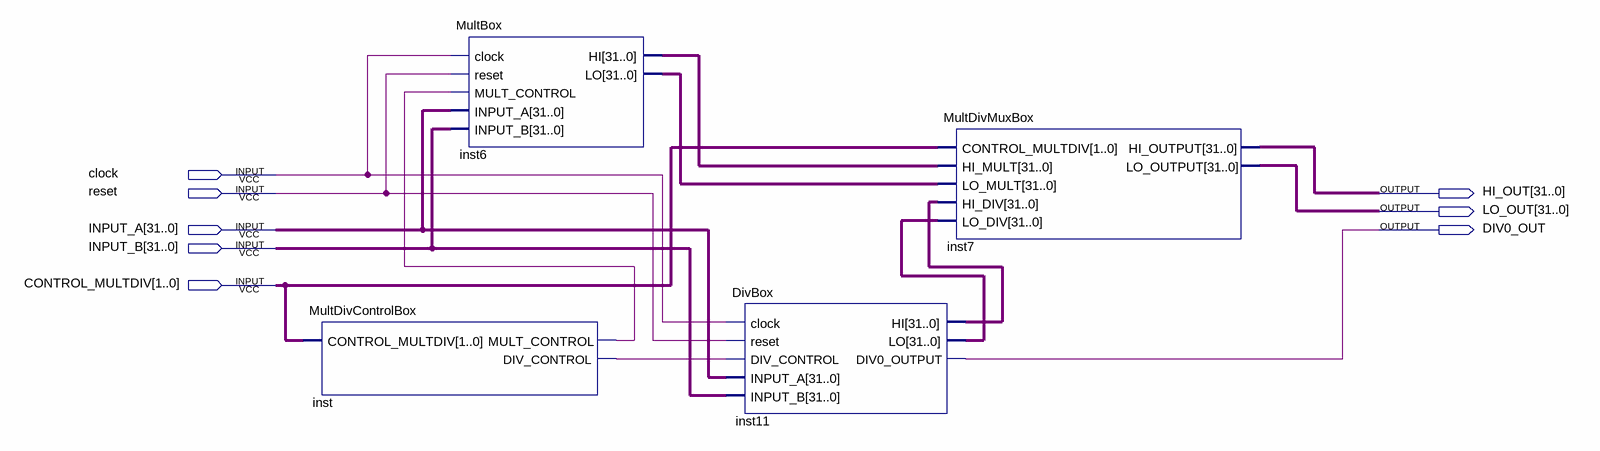
[diagram p0: schematic sheet]
// Quartus schematic MultDiv.bdf as structural Verilog: 4 symbols, 8 pins
module MultDiv (
  input  clock,
  input  reset,
  input  [31:0] INPUT_A,
  input  [31:0] INPUT_B,
  input  [1:0] CONTROL_MULTDIV,
  output [31:0] HI_OUT,
  output [31:0] LO_OUT,
  output DIV0_OUT
);

  wire inst_div_control, inst_mult_control;
  wire [31:0] inst6_hi, inst6_lo, inst11_hi, inst11_lo;

  MultDivControlBox inst (
    .CONTROL_MULTDIV(CONTROL_MULTDIV), .MULT_CONTROL(inst_mult_control), .DIV_CONTROL(inst_div_control));
  MultBox inst6 (
    .clock(clock), .reset(reset), .MULT_CONTROL(inst_mult_control), .INPUT_A(INPUT_A), .INPUT_B(INPUT_B),
    .HI(inst6_hi), .LO(inst6_lo));
  DivBox inst11 (
    .clock(clock), .reset(reset), .DIV_CONTROL(inst_div_control), .INPUT_A(INPUT_A), .INPUT_B(INPUT_B),
    .HI(inst11_hi), .LO(inst11_lo), .DIV0_OUTPUT(DIV0_OUT));
  MultDivMuxBox inst7 (
    .CONTROL_MULTDIV(CONTROL_MULTDIV), .HI_MULT(inst6_hi), .LO_MULT(inst6_lo), .HI_DIV(inst11_hi),
    .LO_DIV(inst11_lo), .HI_OUTPUT(HI_OUT), .LO_OUTPUT(LO_OUT));
endmodule
